# Altium schematic sheet BLE_THERMISTOR.SchDoc
size A4; DocumentNumber: BELNoKey100; ProjectName: BELNoKey100
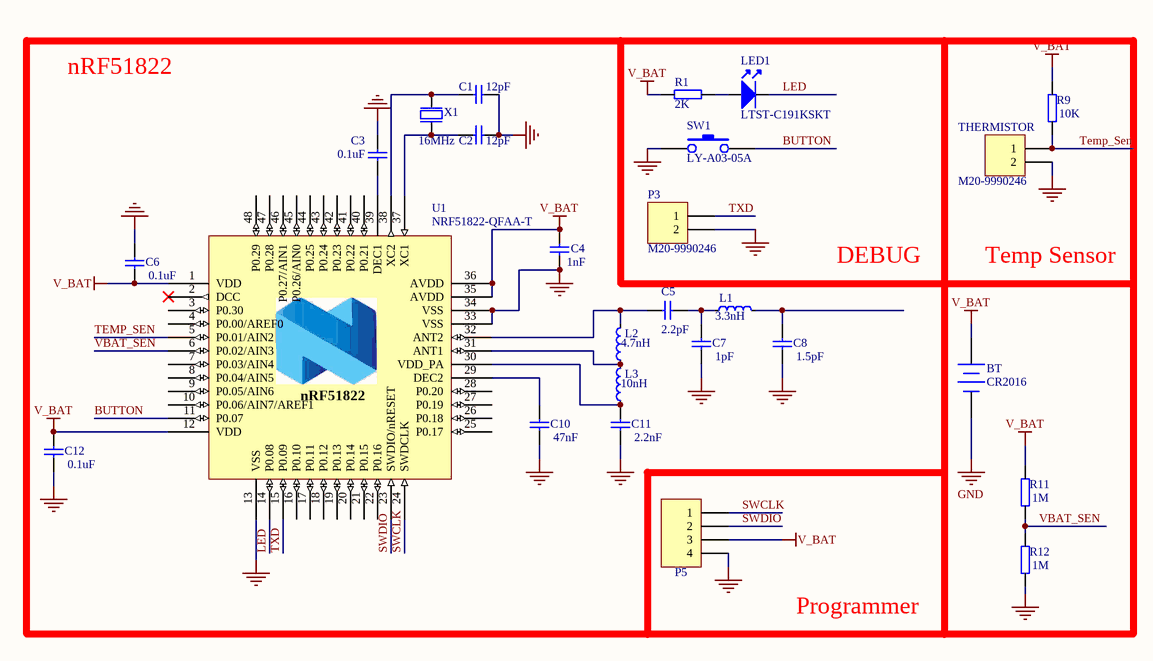
[diagram p0: BLE_THERMISTOR.SchDoc]

## Parts
BT  CR2016  [BLP2016SM-GTR]
C1  value 12pF  [CAPC2012X135N]  (hidden comment: GJM1555C1H120GB01D)
C2  value 12pF  [CAPC2012X135N]  (hidden comment: GJM1555C1H120GB01D)
C3  value 0.1uF  [CAPC2012X135N]  (hidden comment: GRM152C80J104ME19D)
C4  value 1nF  [CAPC2012X135N]  (hidden comment: GCM155R71H102KA37D)
C5  value 2.2pF  [CAPC2012X135N]  (hidden comment: GJM1555C1H2R2BB01D)
C6  value 0.1uF  [CAPC2012X135N]  (hidden comment: GRM152C80J104ME19D)
C7  value 1pF  [CAPC2012X135N]  (hidden comment: GRM1555C1H1R0WA01D)
C8  value 1.5pF  [CAPC2012X135N]  (hidden comment: GJM1555C1H1R5CB01D)
C10  value 47nF  [CAPC2012X135N]  (hidden comment: GCM155R71C473KA37D)
C11  value 2.2nF  [CAPC2012X135N]  (hidden comment: GRM155R71E222KA01D)
C12  value 0.1uF  [CAPC2012X135N]  (hidden comment: GRM152C80J104ME19D)
L1  value 3.3nH  [IND0805]  (hidden comment: L-07C3N3SV6T)
L2  value 4.7nH  [IND0805]  (hidden comment: L-07C4N7SV6T)
L3  value 10nH  [IND0805]  (hidden comment: L-07C10NJV6T)
LED1  LTST-C191KSKT  [LED]
P3  M20-9990246  [HDR1X2]
P5  M20-9990446  [HDR1X4]  (value not drawn)
R1  value 2K  [RESC2012X70N]  (hidden comment: CRCW040210K0FKEDC)
R9  value 10K  [RESC2012X70N]  (hidden comment: CRCW040210K0FKEDC)
R11  value 1M  [RESC2012X70N]  (hidden comment: CRCW04021M00FKED)
R12  value 1M  [RESC2012X70N]  (hidden comment: CRCW04021M00FKED)
SW1  LY-A03-05A  [LY-A03-05A]
THERMISTOR  M20-9990246  [HDR1X2]
U1  NRF51822-QFAA-T  [QFN40P600X600X90-48N]
X1  value 16MHz  [BT-XTAL_2520]  (hidden comment: NX2520SA-16MHZ-STD-CSW-5)

## Nets
GND: BT.2(-) C1.1 C2.1 C3.2 C4.2 C6.2 C7.2 C8.2 C10.2 C11.2 C12.1 P3.2 P5.4 R12.1 SW1.1 THERMISTOR.2 U1.13(VSS) U1.33(VSS) U1.34(VSS) U1.49 X1.2(GND) X1.4(GND)
V_BAT: BT.1(+) C4.1 C6.1 C12.2 P5.3 R1.2 R9.2 R11.2 U1.1(VDD) U1.12(VDD) U1.35(AVDD) U1.36(AVDD)
BUTTON: SW1.2 U1.11(P0.07)
LED: LED1.K U1.14(P0.08)
SWCLK: P5.1 U1.24(SWDCLK)
SWDIO: P5.2 U1.23(SWDIO/nRESET)
TEMP_SEN: R9.1 THERMISTOR.1 U1.5(P0.01/AIN2)
TXD: P3.1 U1.15(P0.09)
VBAT_SEN: R11.1 R12.2 U1.6(P0.02/AIN3)
NetC1_2: C1.2 U1.38(XC2) X1.1(inp)
NetC2_2: C2.2 U1.37(XC1) X1.3(out)
NetC3_1: C3.1 U1.39(DEC1)
NetC5_1: C5.1 L2.2 U1.32(ANT2)
NetC5_2: C5.2 C7.1 L1.1
NetC8_1: C8.1 L1.2
NetC10_1: C10.1 U1.29(DEC2)
NetC11_1: C11.1 L3.1 U1.30(VDD_PA)
NetL2_1: L2.1 L3.2 U1.31(ANT1)
NetLED1_A: LED1.A R1.1

Not connected (* = marked no-connect by the designer): U1 2(DCC)* 3(P0.30) 4(P0.00/AREF0) 7(P0.03/AIN4) 8(P0.04/AIN5) 9(P0.05/AIN6) 10(P0.06/AIN7/AREF1) 16(P0.10) 17(P0.11) 18(P0.12) 19(P0.13) 20(P0.14) 21(P0.15) 22(P0.16) 25(P0.17) 26(P0.18) 27(P0.19) 28(P0.20) 40(P0.21) 41(P0.22) 42(P0.23) 43(P0.24) 44(P0.25) 45(P0.26/AIN0) 46(P0.27/AIN1) 47(P0.28) 48(P0.29)

## Notes on the sheet
- nRF51822
- DEBUG
- Temp Sensor
- Programmer
- (in symbol nRF51x22_QFAx) nRF51822

## Library data of the parts
BT = Battery: BATTERY LITHIUM 3V COIN 20MM; BT case Description: 2016 COIN CELL HOLDER SMT; BT case ManufactureNum: BLP2016SM-GTR
C1 C2 = C0402-12p: CAP CER 12PF 50V C0G/NP0 0402
C3 C6 C12 = C0402-100n: CAP CER 0.1UF 6.3V X6S 0402
C4 = C0402-1n0: CAP CER 1000PF 50V X7R 0402
C5 = C0402-2.2p: CAP CER 2.2PF 50V C0G/NP0 0402
C7 = C0402-1.0p: CAP CER 1PF 50V C0G/NP0 0402
C8 = C0402-1.5p: CAP CER 1.5PF 50V C0G/NP0 0402
C10 = C0402-47n: CAP CER 0.047UF 16V X7R 0402
C11 = C0402-2n2: CAP CER 2200PF 25V X7R 0402
L1 = L0402-3n3: FIXED IND 3.3NH 300MA 190 MOHM
L2 = L0402-4n7: FIXED IND 4.7NH 300MA 240 MOHM
L3 = L0402-10n: FIXED IND 10NH 250MA 450 MOHM
LED1 = T8C02AR-0: LED YELLOW CLEAR 0603 SMD
P3 THERMISTOR = Header 2: SIL VERTICAL PC TAIL PIN HEADER; URL: https://www.digikey.com/products/en?keywords=952-2262-ND
P5 = Header 4: SIL VERTICAL PC TAIL PIN HEADER; URL: https://www.digikey.com/products/en?keywords=952-2266-ND
R1 = Resistor: RES SMD 2K OHM 1% 1/16W 0805
R9 = Resistor: RES SMD 10K OHM 1% 1/16W 0402
R11 R12 = Resistor: RES SMD 1M OHM 1% 1/16W 0402
SW1 = PB_button: SWITCH TACTILE SPST-NO 0.05A 12V; URL: https://detail.1688.com/offer/1283898666.html?spm=a261b.2187593.1998088710.733.R9t4Et
U1 = nRF51x22_QFAx: IC RF TXRX+MCU BLUETOOTH 48VFQFN
X1 = NX2520SA-16MHZ-STD-CSW-5: CRYSTAL 16.0000MHZ 8PF SMD